# EAGLE design ESP12E.6 (EAGLE 8.3.1)
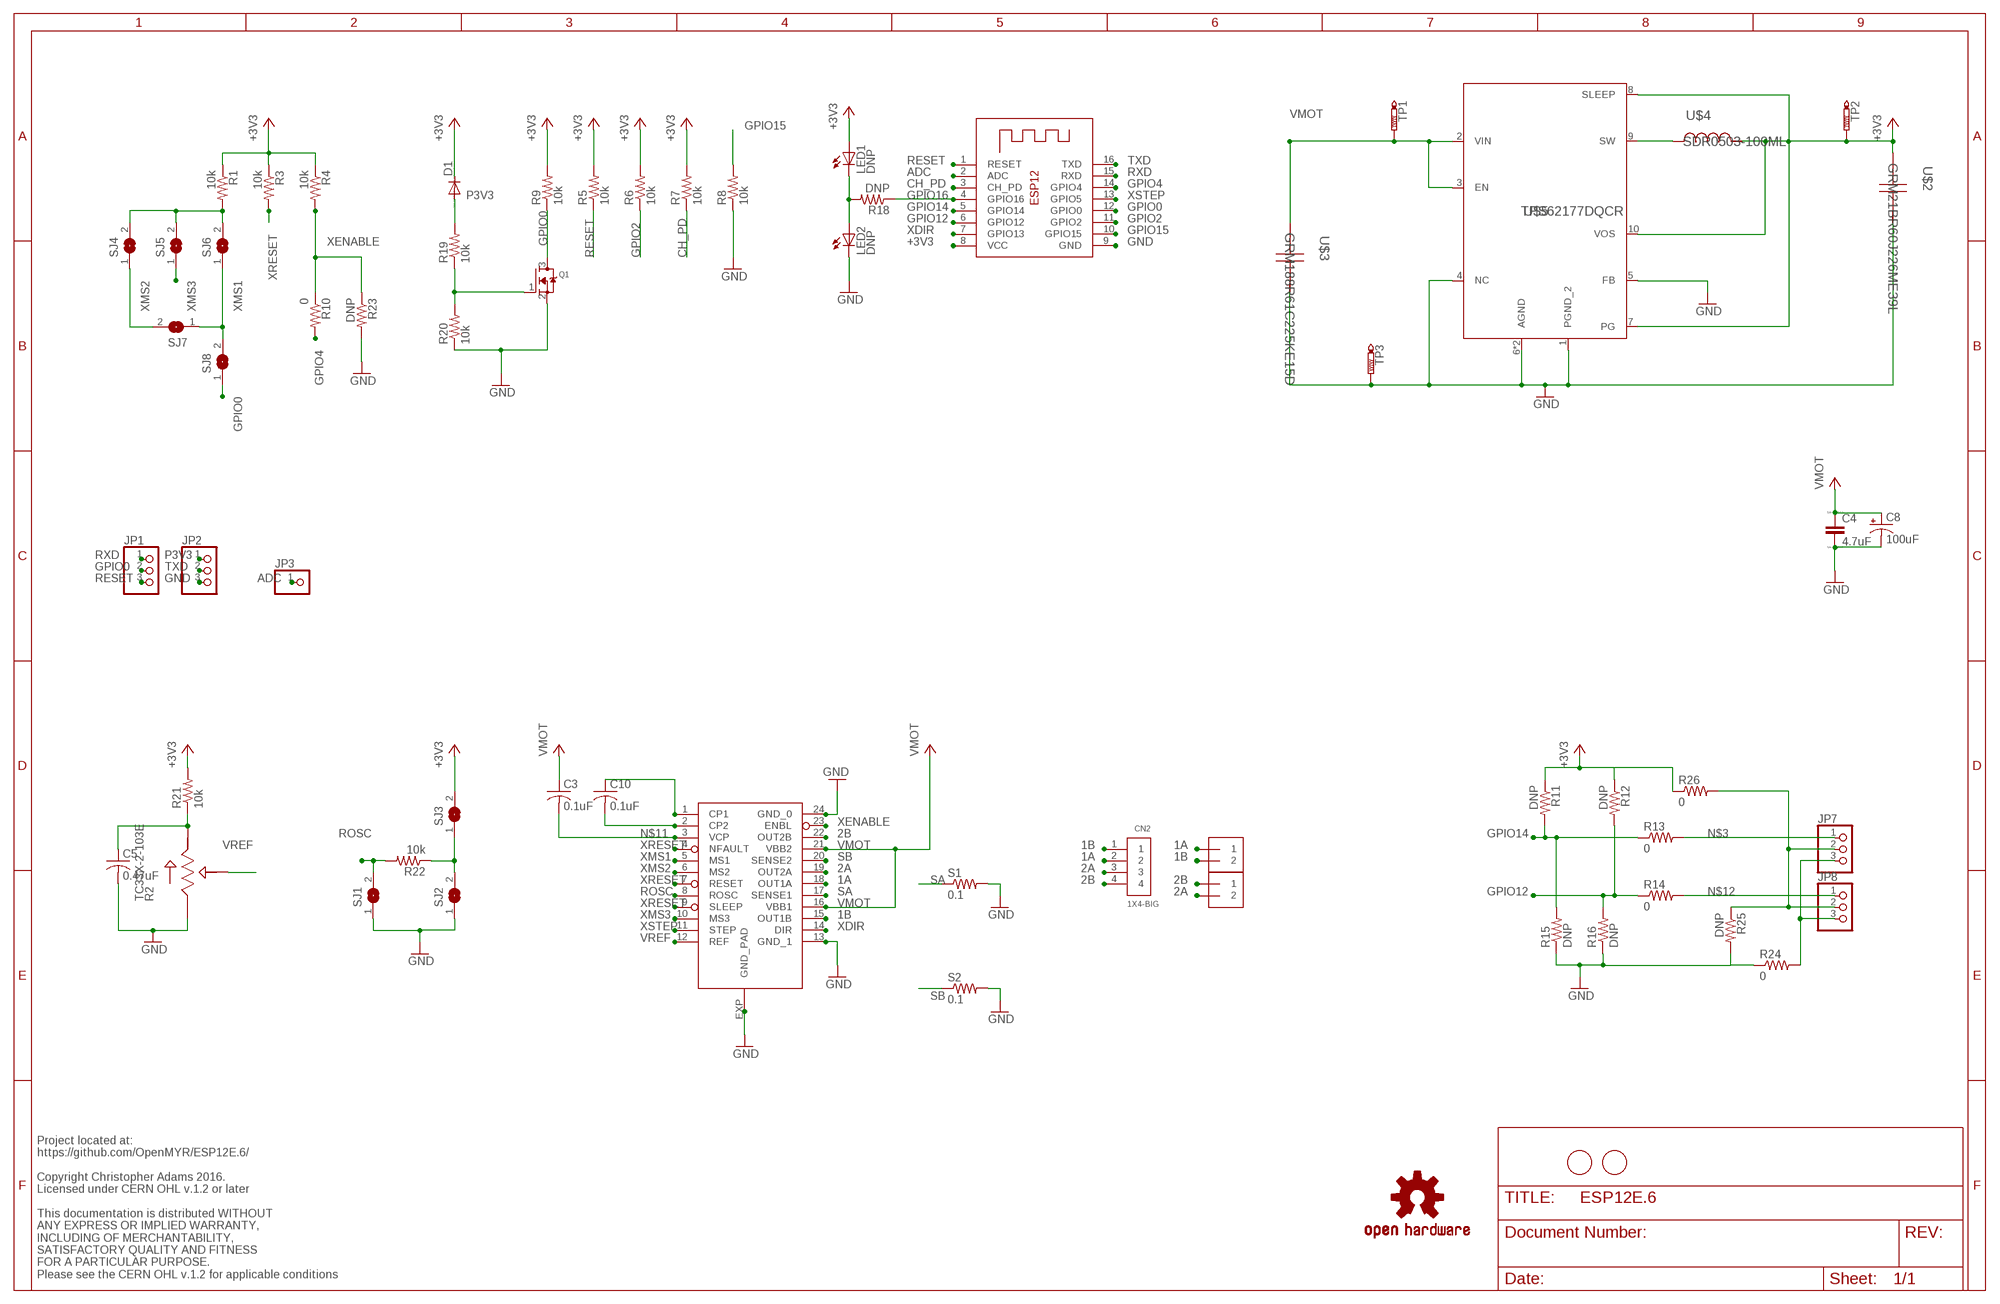
[diagram p0: schematic, sheet 1]

## Parts
C3  0.1uF  C-USC0603K  [C0603K]
C4  4.7uF  C  [C0805]
C5  0.47uF  C-USC0603K  [C0603K]
C8  100uF  CPOL-USD  [PANASONIC_D]
C10  0.1uF  C-USC0603K  [C0603K]
CN2  1X4-BIG  [1X04-BIG]
D1  DIODE-DO214AC  [DO214AC]
FD1  FIDUCIAL  [FIDUCIAL_1MM]
FD2  FIDUCIAL  [FIDUCIAL_1MM]
J1  1X2-3.5MM  [1X2-3.5MM]
J4  1X2-3.5MM  [1X2-3.5MM]
JP1  PINHD-1X3  [1X03]
JP2  PINHD-1X3  [1X03]
JP3  PINHD-1X1CB  [1X01-CLEANBIG]
JP7  PINHD-1X3  [1X03]
JP8  PINHD-1X3  [1X03]
LED1  DNP  LEDCHIPLED_0603  [CHIPLED_0603]
LED2  DNP  LEDCHIPLED_0603  [CHIPLED_0603]
LOGO1  OSHW-LOGOMINI  [OSHW-LOGO-MINI]
Q1  MOSFET-NREFLOW  [SOT23]
R1  10k  R-US_R0603  [R0603]
R2  TC33X-2-103E  [35WR]
R3  10k  R-US_R0603  [R0603]
R4  10k  R-US_R0603  [R0603]
R5  10k  R-US_R0603  [R0603]
R6  10k  R-US_R0603  [R0603]
R7  10k  R-US_R0603  [R0603]
R8  10k  R-US_R0603  [R0603]
R9  10k  R-US_R0603  [R0603]
R10  0  R-US_R0603  [R0603]
R11  DNP  R-US_R0603  [R0603]
R12  DNP  R-US_R0603  [R0603]
R13  0  R-US_R0603  [R0603]
R14  0  R-US_R0603  [R0603]
R15  DNP  R-US_R0603  [R0603]
R16  DNP  R-US_R0603  [R0603]
R18  DNP  R-US_R0603  [R0603]
R19  10k  R-US_R0603  [R0603]
R20  10k  R-US_R0603  [R0603]
R21  10k  R-US_R0603  [R0603]
R22  10k  R-US_R0603  [R0603]
R23  DNP  R-US_R0603  [R0603]
R24  0  R-US_R0603  [R0603]
R25  DNP  R-US_R0603  [R0603]
R26  0  R-US_R0603  [R0603]
S1  0.1  R-US_M0805  [M0805]
S2  0.1  R-US_M0805  [M0805]
SJ1  SJ  [SJ]
SJ2  SJ  [SJ]
SJ3  SJ  [SJ]
SJ4  SJ  [SJ]
SJ5  SJ  [SJ]
SJ6  SJ  [SJ]
SJ7  SJ  [SJ]
SJ8  SJ  [SJ]
TP1  PTR1B1,27  [B1,27]
TP2  PTR1B1,27  [B1,27]
TP3  PTR1B1,27  [B1,27]
U1  A5984  A5984-TSSOP  [TSSOP-28]
U$2  GRM21BR60J226ME39L  [0805]
U$3  GRM188R61C225KE15D  [0603]
U$4  SDR0503-100ML  [SDR0503]
U$5  TPS62177DQCR  [R-PWSON-N10]
X1  ESP-12  [ESP-12]

## Nets
1A: CN2.2 J4.1 U1.18(OUT1A)
1B: CN2.1 J4.2 U1.15(OUT1B)
2A: CN2.3 J1.2 U1.19(OUT2A)
2B: CN2.4 J1.1 U1.22(OUT2B)
+3V3: D1.C LED1.A R1.1 R3.1 R4.1 R5.2 R6.2 R7.2 R9.2 R11.1 R12.1 R21.2 R26.1 SJ3.2 TP2.TP U$2.2 U$4.2 U$5.7(PG) U$5.8(SLEEP) U$5.10(VOS) X1.8(VCC)
ADC: JP3.1 X1.2(ADC)
CH_PD: R7.1 X1.3(CH_PD)
GND: C4.2 C5.2 C8.- JP2.3 LED2.C Q1.2(S) R2.1 R8.1 R15.1 R16.1 R20.1 R23.2 R24.1 R25.2 S1.2 S2.2 SJ1.1 SJ2.1 TP3.TP U1.13(GND_1) U1.24(GND_0) U1.EXP(GND_PAD) U$2.1 U$3.1 U$5.1(PGND_2) U$5.4(NC) U$5.5(FB) U$5.6(AGND) U$5.11(AGND) X1.9(GND)
GPIO0: JP1.2 Q1.3(D) R9.1 SJ8.1 X1.12(GPIO0)
GPIO2: R6.1 X1.11(GPIO2)
GPIO4: R10.2 X1.14(GPIO4)
GPIO12: R12.2 R14.1 R16.2 X1.6(GPIO12)
GPIO14: R11.2 R13.1 R15.2 X1.5(GPIO14)
GPIO15: R8.2 X1.10(GPIO15)
GPIO16: R18.1 X1.4(GPIO16)
MSN: R1.2 SJ4.2 SJ5.2 SJ6.2
N$1: C5.1 R2.3 R21.1
N$2: R22.1 SJ2.2 SJ3.1
N$3: JP7.1 R13.2
N$5: LED1.C LED2.A R18.2
N$6: C10.1 U1.1(CP1)
N$7: Q1.1(G) R19.1 R20.2
N$8: C10.2 U1.2(CP2)
N$9: JP7.3 JP8.3 R24.2
N$10: JP7.2 JP8.2 R25.1 R26.2
N$11: C3.2 U1.3(VCP)
N$12: JP8.1 R14.2
N$17: U$4.1 U$5.9(SW)
P3V3: D1.A JP2.1 R19.2
RESET: JP1.3 R5.1 X1.1(RESET)
ROSC: R22.2 SJ1.2 U1.8(ROSC)
RXD: JP1.1 X1.15(RXD)
SA: S1.1 U1.17(SENSE1)
SB: S2.1 U1.20(SENSE2)
TXD: JP2.2 X1.16(TXD)
VMOT: C3.1 C4.1 C8.+ TP1.TP U1.16(VBB1) U1.21(VBB2) U$3.2 U$5.2(VIN) U$5.3(EN)
VREF: R2.2 U1.12(REF)
XDIR: U1.14(DIR) X1.7(GPIO13)
XENABLE: R4.2 R10.1 R23.1 U1.23(ENBL)
XMS1: SJ6.1 SJ7.1 SJ8.2 U1.5(MS1)
XMS2: SJ4.1 SJ7.2 U1.6(MS2)
XMS3: SJ5.1 U1.10(MS3)
XRESET: R3.2 U1.4(NFAULT) U1.7(RESET) U1.9(SLEEP)
XSTEP: U1.11(STEP) X1.13(GPIO5)

## Notes on the sheet
- Project located at:
  https://github.com/OpenMYR/ESP12E.6/
  
  Copyright Christopher Adams 2016.
  Licensed under CERN OHL v.1.2 or later
  
  This documentation is distributed WITHOUT 
  ANY EXPRESS OR IMPLIED WARRANTY, 
  INCLUDING OF MERCHANTABILITY, 
  SATISFACTORY QUALITY AND FITNESS 
  FOR A PARTICULAR PURPOSE. 
  Please see the CERN OHL v.1.2 for applicable conditions

## Library data of the parts
C3 C5 C10 = adafruit:C-US: CAPACITOR, American symbol
C4 = eagle-ltspice:C: CAPACITOR, European symbol; SPICEMODEL: NONE; SPICEPREFIX: C
C8 = rcl:CPOL-US: POLARIZED CAPACITOR, American symbol
CN2 = adafruit:1X4: 4-pin connector
D1 = diode:DIODE-: DIODE
FD1 FD2 = adafruit:FIDUCIAL: For use by pick and place machines to calibrate the vision/machine, 1mm By microbuilder.eu
J1 J4 = adafruit:1X2: 3.5mm Terminal block http://www.ladyada.net/library/pcb/eaglelibrary.html
JP1 JP2 JP7 JP8 = adafruit:PINHD-1X3: PIN HEADER
JP3 = adafruit:PINHD-1X1: Pin header 1x1 for 0.1" spacing With round pins
LED1 LED2 = adafruit:LED: LED OSRAM: - CHIPLED LG R971, LG N971, LY N971, LG Q971, LY Q971, LO R971, LY R971 LH N974, LH R974 LS Q976, LO Q976, LY Q976 LO Q996 - Hyper CHIPLED LW Q18S LB Q993, LB Q99A, LB R99A - SideLED LS A670, LO A670, LY A670, LG A670, LP A670 LB A673, LV A673, LT A673, LW A673 LH A674 LY A675 LS A676, LA A676, LO A676, LY A676, LW A676 LS A679, LY A679, LG A679 - Hyper Micro SIDELED® LS Y876, LA Y876, LO Y876, LY Y876 LT Y87S - SmartLED LW L88C, LW L88S LB L89C, LB L89S, LG L890 LS L89K, LO L89K, LY L89K LS L896, LA L896, LO L896, LY L896 - TOPLED LS T670, LO T670, LY T670, LG T670, LP T670 LSG T670, LSP T670, LSY T670, LOP T670, LYG T670 LG T671, LOG T671, LSG T671 LB T673, LV T673, LT T673, LW T673 LH T674 LS T676, LA T676, LO T676, LY T676, LB T676, LH T676, LSB T676, LW T676 LB T67C, LV T67C, LT T67C, LS T67K, LO T67K, LY T67K, LW E67C LS E67B, LA E67B, LO E67B, LY E67B, LB E67C, LV E67C, LT E67C LW T67C LS T679, LY T679, LG T679 LS T770, LO T770, LY T770, LG T770, LP T770 LB T773, LV T773, LT T773, LW T773 LH T774 LS E675, LA E675, LY E675, LS T675 LS T776, LA T776, LO T776, LY T776, LB T776 LHGB T686 LT T68C, LB T68C - Hyper Mini TOPLED® LB M676 - Mini TOPLED Santana® LG M470 LS M47K, LO M47K, LY M47K Source: http://www.osram.convergy.de/
LOGO1 = SparkFun-Aesthetics:OSHW-LOGO: Open Source Hardware Logo This logo indicates the piece of hardware it is found on incorporates a OSHW license and/or adheres to the definition of open source hardware found here: http://freedomdefined.org/OSHW
Q1 = adafruit:MOSFET-N: N-Channel Mosfet 2N7002E - 60V 260mA SOT23 [Digikey: 2N7002ET1GOSTR-ND] - REEL BSH103 - 30V 850mA SOT23 [Digikey: 568-5013-1-ND]
R1 R3-R16 R18-R26 = adafruit:R-US_: RESISTOR, American symbol
R2 = TC33X-2-103E:TC33X-2-103E: http://octopart.com/tc33x-2-103e-bourns-68150
S1 S2 = resistor:R-US_: RESISTOR, American symbol
SJ1-SJ8 = jumper:SJ: SMD solder JUMPER
TP1-TP3 = testpad:PTR1: TEST PIN
U1 = A5984:A5984-TSSOP
U$2 = TPS62177:GRM21BR60J226ME39L; CAP: 2.2E-5; ESR: 0.0; IRMS: 0.0; MANUFACTURER_NAME: MuRata; MANUFACTURER_PART_NUMBER: GRM21BR60J226ME39L; VDC: 6.3; VENDOR: MuRata
U$3 = TPS62177:GRM188R61C225KE15D; CAP: 2.2E-6; ESR: 0.0; IRMS: 0.0; MANUFACTURER_NAME: MuRata; MANUFACTURER_PART_NUMBER: GRM188R61C225KE15D; VDC: 16.0; VENDOR: MuRata
U$4 = TPS62177:SDR0503-100ML; DCR: 0.13; IDC: 1.3; L: 1.0E-5; MANUFACTURER_NAME: Bourns; MANUFACTURER_PART_NUMBER: SDR0503-100ML; VENDOR: Bourns
U$5 = TPS62177:TPS62177DQCR; DATASHEETURL: http://www.ti.com/product/tps62175; FREQUENCY: 1000000.0; IMAX: 0.5; MANUFACTURER_NAME: Texas Instruments; MANUFACTURER_PART_NUMBER: TPS62175DQCR; MKTG_PACKAGE: TPS62175; NSID: TPS62175DQCR; PACKAGE: TPS62175; VENDOR: Texas Instruments
X1 = adafruit:ESP-12

## Board
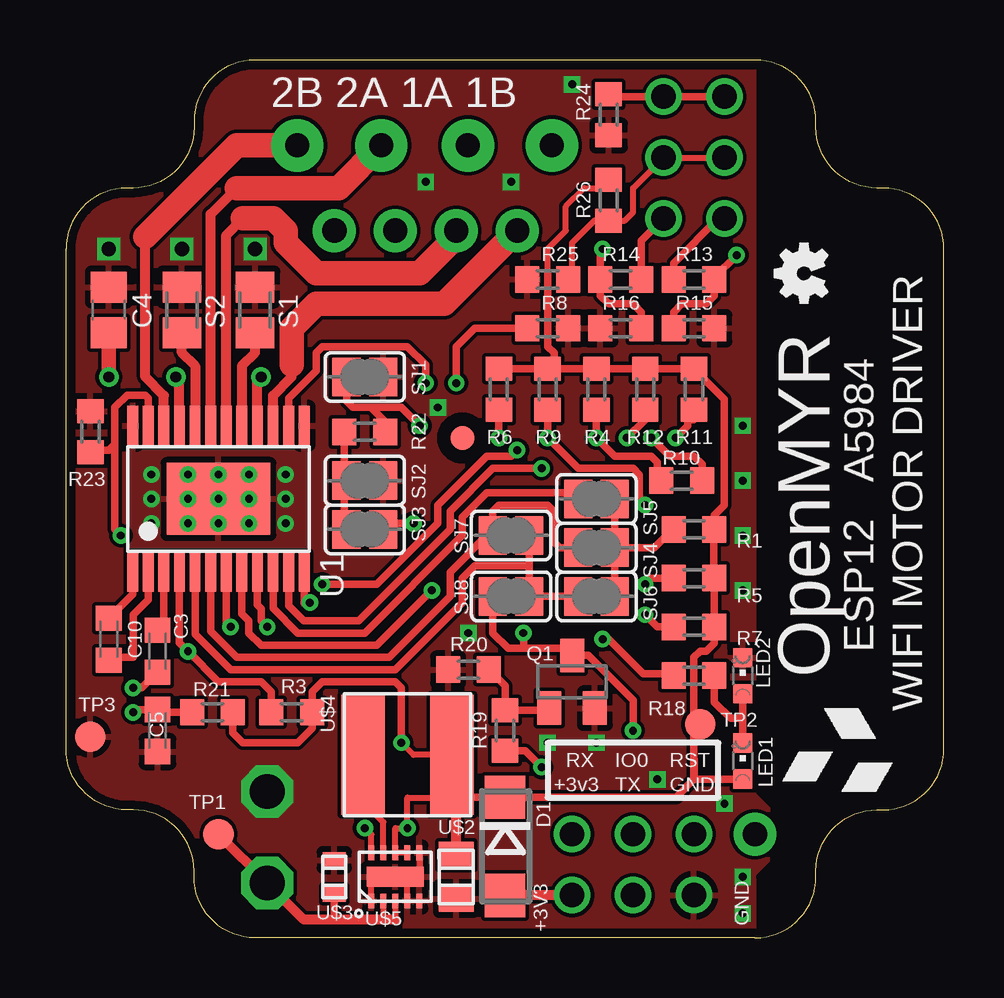
[diagram p1: board, top side]
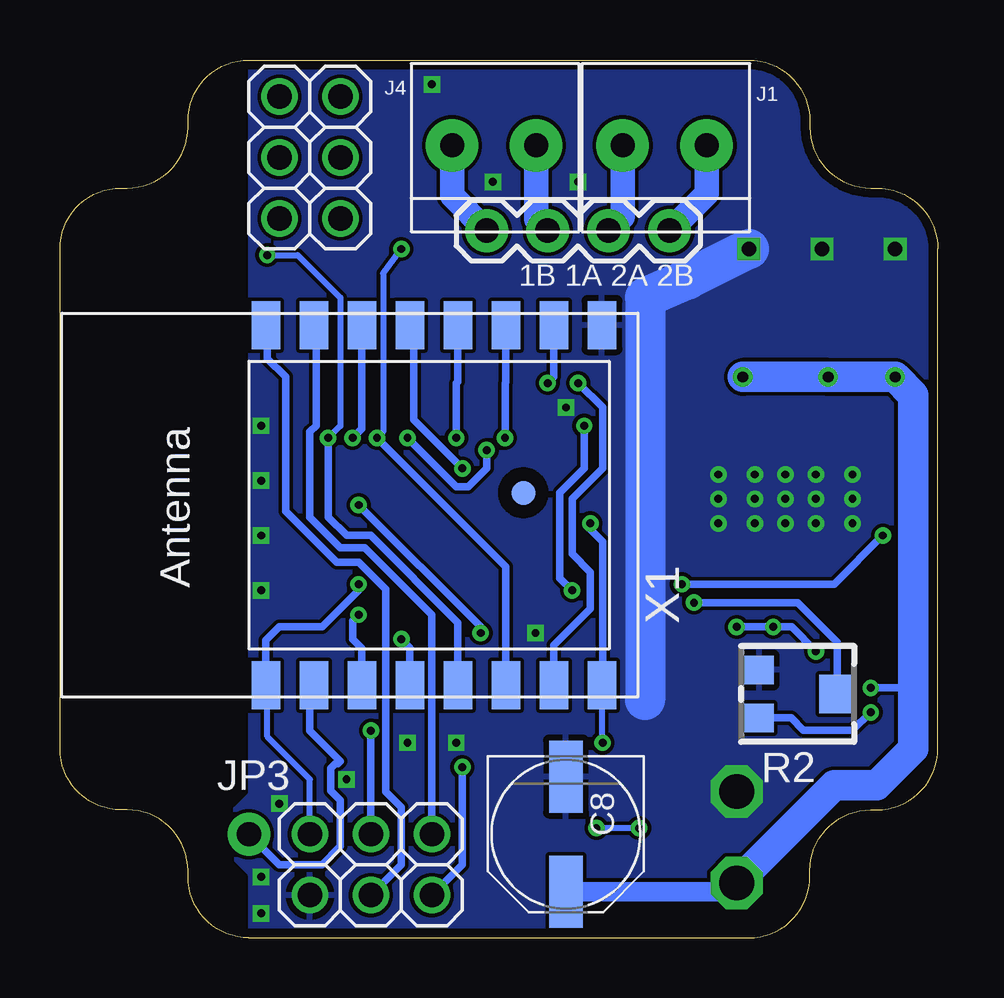
[diagram p2: board, bottom side, seen from below]

Size 36.58 x 36.58 mm. Coordinates in mm from the lower left corner, seen from the top.
Outline: 2.79,31.24 2.54,31.24 arc90 0,28.7 0,7.87 arc90 2.54,5.33 2.79,5.33 arc-90 5.33,2.79 5.33,2.54 arc90 7.87,0 28.7,0 arc90 31.24,2.54 31.24,2.79 arc-90 33.78,5.33 34.04,5.33 arc90 36.58,7.87 36.58,28.7 arc90 34.04,31.24 33.78,31.24 arc-90 31.24,33.78 31.24,34.04 arc90 28.7,36.58 7.87,36.58 arc90 5.33,34.04 5.33,33.78 arc-90 2.79,31.24
Copper layers (1*16): Top 0.0356mm / dielectric 1.5011mm / Bottom 0.0356mm
Design rules "LaenPCBOrder *": minimum track width 6mil, minimum drill 13mil, track to track 6mil, track to pad 6mil, pad to pad 6mil, via to via 6mil, smd to smd 6mil, copper to edge 15mil, drill to drill 6mil, minimum pad ring 7mil, minimum via ring 7mil, stop-mask expansion 3mil, vias tented up to drill 14mil, thermal gap 10mil
bKeepout: area 3,17 to 9.4,23.4; area 1.8,14.2 to 10.9,23.4
tRestrict: area 29,0 to 36.6,36.6
bRestrict: area 29,0 to 36.6,36.6

### Footprints (pad centres in the part's own frame; a part is rotated, then mirrored left to right if it is on the bottom)
C0603K = smd 1.05 x 1.08: 1 -0.875,0; 2 0.875,0
C0805 = smd 1.3 x 1.5: 1 -0.95,0; 2 0.95,0
PANASONIC_D = smd 3 x 1.4: + 2.4,0; - -2.4,0
1X04-BIG = drill 1.016 pad 1.778: 1 0,0; 2 2.54,0; 3 5.08,0; 4 7.62,0
DO214AC = smd 1.8 x 1.7: A 2.05,0; C -2.05,0
FIDUCIAL_1MM = smd 1 x 1: 1 0,0
1X2-3.5MM = drill 1 pad 2.184: 1 1.8,0; 2 -1.7,0
1X03 = drill 1.016: 1 -2.54,0; 2 0,0; 3 2.54,0
1X01-CLEANBIG = drill 1.016 pad 1.778: 1 0,0
CHIPLED_0603 = smd 0.8 x 0.8: A 0,-0.75; C 0,0.75
SOT23 = smd 1 x 1.4: 1 -0.95,-1.1; 2 0.95,-1.1; 3 0,1.1
R0603 = smd 1 x 1.1: 1 -0.85,0; 2 0.85,0
35WR = smd 1.2 x 1.2: 1 -1,-1.6; 3 1,-1.6 | smd 1.6 x 1.5: 2 0,1.65
M0805 = smd 1.3 x 1.6: 1 -0.95,0; 2 0.95,0
SJ = smd 1.168 x 1.6: 1 -0.762,0; 2 0.762,0
B1,27 = smd 1.27 x 1.27: TP 0,0
TSSOP-28 = smd 0.45 x 1.65: 1 -3.575,-3.05; 2 -2.925,-3.05; 3 -2.275,-3.05; 4 -1.625,-3.05; 5 -0.975,-3.05; 6 -0.325,-3.05; 7 0.325,-3.05; 8 0.975,-3.05; 9 1.625,-3.05; 10 2.275,-3.05; 11 2.925,-3.05; 12 3.575,-3.05; 13 3.575,3.05; 14 2.925,3.05; 15 2.275,3.05; 16 1.625,3.05; 17 0.975,3.05; 18 0.325,3.05; 19 -0.325,3.05; 20 -0.975,3.05; 21 -1.625,3.05; 22 -2.275,3.05; 23 -2.925,3.05; 24 -3.575,3.05 | smd 4.32 x 3: EXP 0,0
0805 = smd 1.118 x 1.448: 1 -0.902,0; 2 0.902,0
0603 = smd 0.66 x 0.965: 1 -0.699,0; 2 0.699,0
SDR0503 = smd 1.803 x 5.004: 1 -1.854,0; 2 1.854,0
R-PWSON-N10 = smd 0.61 x 0.254: 1 -1.003,1; 2 -1.003,0.5; 3 -1.003,0; 4 -1.003,-0.5; 5 -1.003,-1; 6 1.003,-1; 7 1.003,-0.5; 8 1.003,0; 9 1.003,0.5; 10 1.003,1 | smd 0.838 x 2.388: 11 0,0
ESP-12 = smd 2 x 1.2: 1 -7.5,4.5; 2 -7.5,2.5; 3 -7.5,0.5; 4 -7.5,-1.5; 5 -7.5,-3.5; 6 -7.5,-5.5; 7 -7.5,-7.5; 8 -7.5,-9.5; 9 7.5,-9.5; 10 7.5,-7.5; 11 7.5,-5.5; 12 7.5,-3.5; 13 7.5,-1.5; 14 7.5,0.5; 15 7.5,2.5; 16 7.5,4.5

### Placement (x,y rotation side)
C3  3.81,11.94 90 top
C4  1.78,26.16 90 top
C5  3.81,8.64 270 top
C8  15.49,4.32 270 bottom
C10  1.78,12.45 270 top
CN2  18.8,29.46 0 bottom
D1  18.29,3.81 270 top
FD1  17.27,18.54 0 bottom
FD2  16.51,20.83 0 top
J1  11.43,33.02 0 bottom
J4  18.54,33.02 0 bottom
JP1  23.62,4.32 180 bottom
JP2  23.62,1.78 180 bottom
JP3  28.7,4.32 0 bottom
JP7  27.43,32.51 90 bottom
JP8  24.89,32.51 90 bottom
LED1  28.19,7.37 0 top
LED2  28.19,10.92 0 top
LOGO1  30.73,27.69 90 top
Q1  21.08,10.67 0 top
R1  26.16,17.02 180 top
R2  5.84,10.16 270 bottom
R3  9.4,9.4 180 top
R4  22.1,22.86 270 top
R5  26.16,14.99 0 top
R6  18.03,22.86 90 top
R7  26.16,12.95 0 top
R8  20.07,25.4 180 top
R9  20.07,22.86 90 top
R10  25.65,19.05 0 top
R11  26.16,22.86 270 top
R12  24.13,22.86 270 top
R13  26.16,27.43 180 top
R14  23.11,27.43 0 top
R15  26.16,25.4 180 top
R16  23.11,25.4 0 top
R18  26.16,10.92 0 top
R19  18.29,8.64 270 top
R20  16.76,11.18 0 top
R21  6.1,9.4 0 top
R22  12.45,21.08 0 top
R23  1.02,21.08 90 top
R24  22.61,34.29 90 top
R25  20.07,27.43 180 top
R26  22.61,30.73 270 top
S1  7.87,26.16 90 top
S2  4.83,26.16 90 top
SJ1  12.45,23.37 180 top
SJ2  12.45,19.05 180 top
SJ3  12.45,17.02 0 top
SJ4  22.1,16.26 0 top
SJ5  22.1,18.29 0 top
SJ6  22.1,14.22 0 top
SJ7  18.54,16.76 180 top
SJ8  18.54,14.22 0 top
TP1  6.35,4.32 0 top
TP2  26.42,8.89 0 top
TP3  1.02,8.38 0 top
U1  6.35,18.29 0 top
U$2  16.26,2.54 90 top
U$3  11.18,2.54 270 top
U$4  14.22,7.62 0 top
U$5  13.72,2.54 90 top
X1  23.5,18.03 90 bottom

### Tracks (layer width: path | path; a pad name or v marks a point on that pad's centre or on a via)
1A
  Top 0.406: U1.18 6.67,29.28 7.37,29.97
  Top 1.016: CN2.2 16.26,29.21 14.73,27.69 10.41,27.69 9.14,28.96 9.14,29.46 8.64,29.97 7.37,29.97
  Bottom 1.016: J4.1 16.74,29.95 CN2.2
1B
  Top 0.406: U1.15 8.62,22.59 9.4,23.37 9.4,23.88
  Top 1.016: 9.4,23.88 9.4,25.4 10.41,26.42 15.75,26.42 CN2.1
  Bottom 1.016: J4.2 20.24,30.91 CN2.1
2A
  Top 0.406: U1.19 6.03,30.16 7.11,31.24
  Top 1.016: 7.11,31.24 11.35,31.24 J1.2
  Bottom 1.016: J1.2 13.13,30.05 CN2.3
2B
  Top 0.406: U1.22 4.08,22.59 3.3,23.37 3.3,29.21
  Top 1.016: 3.3,29.21 7.11,33.02 J1.1
  Bottom 1.016: J1.1 9.63,31.01 CN2.4
+3V3  (via drill 0.33)
  Top 0.254: 20.07,27.69 20.07,28.7 20.83,29.46 20.83,30.48 21.59,31.24 22.52,31.24 R26.1 | U$5.10 12.72,4.3 v12.45,4.57 | U$4.2 14.48,7.62 v13.97,8.13 | 16.68,5.42 16.26,5.84 14.22,5.84 v14.22,4.57 13.72,4.57 U$5.8 U$5.7
  Top 0.305: 26.16,8.38 26.16,6.6 25.42,5.86 D1.C 16.49,5.86 16.26,6.1 | LED1.A 26.17,6.62 26.16,8.38 | 26.16,8.38 26.16,11.68 26.42,11.94 26.67,11.94 27.01,12.28 R7.2 R5.2 26.99,15.01 26.99,16.79 R1.1 27.01,17.61 27.43,18.03 27.43,22.44 R11.1 R12.1 R4.1 20.33,23.71 | R6.2 R9.2 20.33,23.71 | 20.33,23.71 20.33,24.37 20.07,24.64 20.07,27.69 | 16.26,6.1 16.26,7.44 U$4.2 | 16.26,5.84 16.26,6.1 | v13.97,8.13 13.97,10.41 13.72,10.67 10.67,10.67 10.25,10.25 R3.1 10.25,8.72 9.65,8.13 7.37,8.13 6.95,8.55 R21.2 | SJ3.2 13.46,17.27 v14.48,17.27 | 26.16,8.38 26.42,8.64 TP2.TP
  Top 0.406: U$2.2 16.26,6.1
  Bottom 0.254: v12.45,4.57 v14.22,4.57 | X1.8 13.99,8.15 v13.97,8.13
  Bottom 0.305: X1.8 13.97,10.56 13.97,16.51 14.48,17.02 v14.48,17.27
ADC
  Bottom 0.305: X1.2 26.16,10.37 26.16,8.64 24.89,7.37 25.01,7.25 25.11,7.25 25.29,7.07 25.29,6.13 24.89,5.74 24.89,3.81 25.65,3.05 27.43,3.05 JP3.1
CH_PD  (via drill 0.33)
  Top 0.305: R7.1 24.64,12.95 v24.13,13.46
  Bottom 0.305: X1.3 24,12.06 24.38,12.45 24.38,13.21 v24.13,13.46
GND  (via drill 0.33, 0.6, 1.45)
  Top 0.254: U$5.1 12.72,2.52 12.7,2.54 U$5.11 14.22,2.54 | U$5.4 14.22,2.53 14.22,2.54 | U$5.6 14.73,3.53 14.73,2.54 14.22,2.54
  Bottom 0.152: 14.13,25.56 X1.9
  Bottom 1.676: v7.87,28.7 10.41,27.43 12.19,26.67 12.19,9.91
  other vias: 9.14,19.3 7.62,19.3 6.35,19.3 5.08,19.3 3.56,19.3 9.14,18.29 7.62,18.29 6.35,18.29 5.08,18.29 3.56,18.29 3.56,17.27 5.08,17.27 6.35,17.27 7.62,17.27 9.14,17.27 28.19,21.34 28.19,19.05 28.19,16.76 28.19,14.48 8.38,6.1 20.07,8.13 28.19,2.54 28.19,1.02 15.49,22.1 21.08,35.56 4.83,28.7 1.78,28.7 18.54,31.5 14.99,31.5 24.64,6.6 16.76,12.7 22.1,8.13 27.43,5.59
  pour Bottom (no thermals): 11.43,23.11 11.43,16.76 1.02,14.22
  pour Top (rank 6): 36.58,36.58 36.58,0 0.25,0 0,0.25 0,36.32
  pour Bottom (rank 6): 36.58,0 36.58,36.58 0,36.32 0,0
GPIO0  (via drill 0.33)
  Top 0.152: 21.27,12.06 Q1.3
  Top 0.305: 21.25,11.94 Q1.3 21.76,11.77 23.62,9.91 v23.62,8.64 | R9.1 v20.07,20.83 21.34,19.56 23.62,19.56 23.88,19.3 23.88,18.29 v24.13,18.03 | 19.06,12.06 19.06,12.69 v19.05,12.7 | 21.27,12.06 19.06,12.06 | 19.06,12.06 18.41,12.06 17.78,12.7 SJ8.1
  Bottom 0.152: 20,25.4 X1.12
  Bottom 0.305: v20.07,20.83 20.07,23.11 20,23.18 20,25.4 | v24.13,18.03 19.05,12.95 v19.05,12.7 | JP1.2 v23.62,8.64
GPIO2  (via drill 0.33)
  Top 0.305: R6.1 v18.03,20.83
  Bottom 0.305: v18.03,20.83 18.03,23.11 18,23.15 X1.11
GPIO4  (via drill 0.33)
  Top 0.305: R10.2 26.5,19.72 26.16,20.07 25.15,20.07 v24.38,20.83
  Bottom 0.305: X1.14 24,21.22 v24.38,20.83
GPIO12  (via drill 0.33)
  Top 0.305: R16.2 23.96,26.07 23.62,26.42 22.61,26.42 22.26,26.76 R14.1 22.26,28.61 v22.35,28.7 | R12.2 24.13,21.59 v23.37,20.83
  Bottom 0.254: v23.37,20.83 23.11,21.08 23.11,27.69 v22.35,28.7
  Bottom 0.305: X1.6 18,15.46 v23.37,20.83
GPIO14  (via drill 0.33)
  Top 0.305: R15.2 25.31,26.07 25.65,26.42 26.67,26.42 27.01,26.76 R13.1 27.01,27.52 v27.94,28.45 | v25.4,20.83 25.91,21.34 25.91,21.59 26.16,21.59 R11.2
  Bottom 0.254: v27.94,28.45 26.67,28.45 24.89,26.67 24.89,21.34 v25.4,20.83
  Bottom 0.305: v25.4,20.83 25.4,17.53 24.64,16.76 23.62,16.76 20,13.14 X1.5
GPIO15  (via drill 0.33)
  Top 0.305: v16.26,23.11 16.26,24.64 17.02,25.4 R8.2
  Bottom 0.305: X1.10 15.99,23.38 v16.26,23.11
GPIO16  (via drill 0.33)
  Top 0.305: R18.1 25.31,11.01 24.04,11.01 22.61,12.45 v22.35,12.45
  Bottom 0.254: 21.84,10.38 X1.4
  Bottom 0.305: v22.35,12.45 22,12.09 X1.4
MSN
  Top 0.152: 25.24,16.99 R1.2
  Top 0.305: SJ5.2 SJ4.2 | SJ4.2 SJ6.2 | 25.24,16.99 24.51,16.26 SJ4.2
N$1  (via drill 0.33)
  Top 0.305: v2.79,9.4 2.91,9.51 C5.1 3.92,9.4 R21.1
  Bottom 0.305: R2.3 6.11,9.16 5.6,8.65 3.57,8.65 v2.79,9.4
N$2
  Top 0.305: 11.6,17.11 SJ3.1 11.6,17.18 11.6,18.96 SJ2.2 11.6,19.14 R22.1
N$3
  Top 0.305: R13.2 25.31,28.11 27.18,29.97 JP7.1
N$5
  Top 0.305: LED1.C 28.19,9.14 | 28.19,9.14 LED2.A | R18.2 27.01,9.82 27.69,9.14 28.19,9.14
N$6
  Top 0.305: 2.77,15.22 U1.1 2.77,14.32 C10.1
N$7
  Top 0.305: R20.2 18.29,10.5 R19.1 20.05,9.49 Q1.1
N$8
  Top 0.305: C10.2 2.4,11.68 2.79,11.68 2.79,13.46 3.42,14.09 U1.2
N$9
  Top 0.152: 22.7,35.08 R24.2
  Top 0.305: R24.2 22.69,35.05 JP8.3 JP7.3
N$10
  Top 0.254: R25.1 21.08,27.6 21.08,28.96 22.01,29.88 R26.2 23.28,29.88 23.62,30.23 23.62,31.24 JP8.2 JP7.2
N$11
  Top 0.305: U1.3 4.08,13.08 C3.2
N$12
  Top 0.305: R14.2 23.96,29.04 JP8.1
N$17
  Top 0.254: U$5.9 13.22,4.82 12.95,5.08 12.95,5.33 12.45,5.84 11.68,5.84 11.68,7.54 U$4.1
P3V3  (via drill 0.33)
  Top 0.305: R19.2 19.14,7.79 v19.81,7.11
  Top 0.406: JP2.1 18.52,1.78 D1.A
  Bottom 0.305: v19.81,7.11 19.81,3.05 JP2.1
RESET  (via drill 0.33)
  Top 0.305: R5.1 24.38,14.99 v24.13,14.73
  Bottom 0.254: JP1.3 26.16,6.6 27.94,8.38 27.94,10.48 X1.1
  Bottom 0.305: X1.1 28,12.39 27.43,12.95 25.65,12.95 24.13,14.48 v24.13,14.73
ROSC  (via drill 0.33)
  Top 0.305: SJ1.2 11.68,22.35 11.94,22.1 12.7,22.1 | R22.2 13.3,21.5 12.7,22.1 | 12.7,22.1 13.97,22.1 v14.73,21.34 | U1.8 7.33,13.5 7.62,13.21 7.62,12.7 8.13,12.19 12.95,12.19 v15.24,14.48
  Bottom 0.305: v14.73,21.34 14.73,19.56 15.75,18.54 15.75,14.99 v15.24,14.48
RXD
  Bottom 0.305: 25.91,25.62 X1.15 | 25.65,25.88 X1.15 | X1.15 25.91,25.4 25.91,21.34 26.16,21.08 26.16,17.53 24.89,16.26 23.88,16.26 21.08,13.46 JP1.1
SA
  Top 0.406: U1.17 7.33,23.84 7.87,24.38 S1.1
SB
  Top 0.406: U1.20 5.38,23.84 4.83,24.38 S2.1
TXD
  Bottom 0.305: 27.94,25.59 X1.16 28,24.69 27.94,24.64 27.94,24.13 27.18,23.37 27.18,17.78 25.05,15.65 24.13,15.65 23,14.52 23,6.08 22.35,5.43 22.35,3.05 JP2.2
VMOT  (via drill 0.33, 0.46, 1.45)
  Top 0.254: U$5.2 13.22,0.77 13.21,0.76 | U$5.3 13.72,0.76
  Top 0.305: 3.81,11.43 C3.1 3.16,10.41 v2.79,10.41 | U$3.2 11.18,0.76
  Top 0.406: U1.16 7.97,23.21 v8.13,23.37 | U1.21 4.72,23.21 v4.57,23.37 | 13.72,0.76 13.21,0.76 11.18,0.76 9.91,0.76 v8.38,2.29 TP1.TP
  Top 0.61: C4.1 v1.78,23.37
  Bottom 0.305: 1.27,10.41 1.52,10.41 | 1.52,10.41 1.02,10.92 | 1.52,10.41 v2.79,10.41
  Bottom 0.813: v8.38,2.29 9,1.92 C8.+
  Bottom 1.27: v8.13,23.37 v4.57,23.37 v1.78,23.37 1.02,22.61 1.02,10.92 1.02,7.87 2.54,6.35 4.32,6.35 v8.38,2.29
VREF  (via drill 0.33)
  Top 0.305: U1.12 9.93,13.95 v10.16,13.97
  Bottom 0.305: R2.2 4.19,12.32 5.84,13.97 v10.16,13.97
XDIR  (via drill 0.33)
  Top 0.305: U1.14 9.28,22.48 10.41,23.62 10.41,24.38 10.67,24.64 14.22,24.64 14.99,23.88 v14.99,23.11
  Bottom 0.305: X1.7 16,10.54 16,12.19 14.48,13.72 14.48,15.24 15.24,16 15.24,18.29 13.97,19.56 13.97,22.1 v14.99,23.11
XENABLE  (via drill 0.33)
  Top 0.254: 24.55,19.39 R10.1
  Top 0.305: U1.23 3.42,22.48 3.3,22.61 2.54,22.61 2.03,22.1 2.03,20.57 | 2.03,20.57 1.78,20.32 1.1,20.32 R23.1 | R4.2 v22.1,20.83 22.86,20.07 24.38,20.07 24.64,19.81 24.64,19.22 R10.1 | 2.03,20.57 2.03,17.02 v2.29,16.76 | v10.67,14.73 12.95,14.73 15.49,17.27 15.49,18.03 17.53,20.07 18.54,20.07 v18.8,20.32
  Bottom 0.305: v2.29,16.76 4.32,14.73 v10.67,14.73 | v22.1,20.83 20.07,18.8 19.56,18.8 18.8,19.56 v18.8,20.32
XMS1
  Top 0.305: U1.5 5.38,12.66 6.86,11.18 13.72,11.18 16.51,13.97 16.51,14.99 17.02,15.49 19.3,15.49 | SJ7.1 19.3,15.49 | 19.3,15.49 SJ8.2 SJ6.1
XMS2
  Top 0.305: U1.6 6.03,12.77 7.11,11.68 13.46,11.68 16,14.22 16,15.24 17.53,16.76 SJ7.2 17.78,17.78 18.03,18.03 20.07,18.03 20.32,17.78 20.32,16.51 20.57,16.26 SJ4.1
XMS3
  Top 0.305: U1.10 8.62,13.73 9.65,12.7 12.45,12.7 16.51,16.76 16.51,17.53 17.53,18.54 20.83,18.54 21.08,18.29 SJ5.1
XRESET  (via drill 0.33)
  Top 0.305: U1.4 4.72,12.29 v5.08,11.94 6.35,10.67 8.13,10.67 8.55,10.25 R3.2 | U1.9 7.97,13.87 8.13,13.72 8.13,13.21 v8.38,12.95 | 6.79,13.03 v6.86,12.95 6.67,13.14 U1.7
  Bottom 0.305: v5.08,11.94 6.1,12.95 v6.86,12.95 8.13,12.95 arc-90 v8.38,12.95
XSTEP  (via drill 0.33)
  Top 0.305: U1.11 9.28,13.84 9.91,13.21 12.19,13.21 16,17.02 16,17.78 17.78,19.56 v19.81,19.56
  Bottom 0.305: 21.84,25.38 21.83,25.38 | 21.84,25.38 X1.13 | 21.84,25.38 21.84,21.59 v19.81,19.56

### Text on the board
tPlace: 2B 2A 1A 1B | C4 | S2 | S1 | WIFI MOTOR DRIVER | OpenMYR | ESP12 A5984 | C3 | RX | IO0 | RST | +3v3 | TX | GND | GND | +3V3
bPlace: 1B 1A 2A 2B
tNames: C5
Document: Project located at: / https://github.com/OpenMYR/ESP12E.6/ / / Copyright Christopher Adams 2016. / Licensed under CERN OHL v.1.2 or later / / This documentation is distributed WITHOUT / ANY EXPRESS OR IMPLIED WARRANTY, / INCLUDING OF MERCHANTABILITY, / SATISFACTORY QUALITY AND FITNESS / FOR A PARTICULAR PURPOSE. / Please see the CERN OHL v.1.2 for applicable conditions
_bsilk: GND | +3V3 | IO12 | IO14 | - | +